# Altium project ntcsensor.PrjPcb
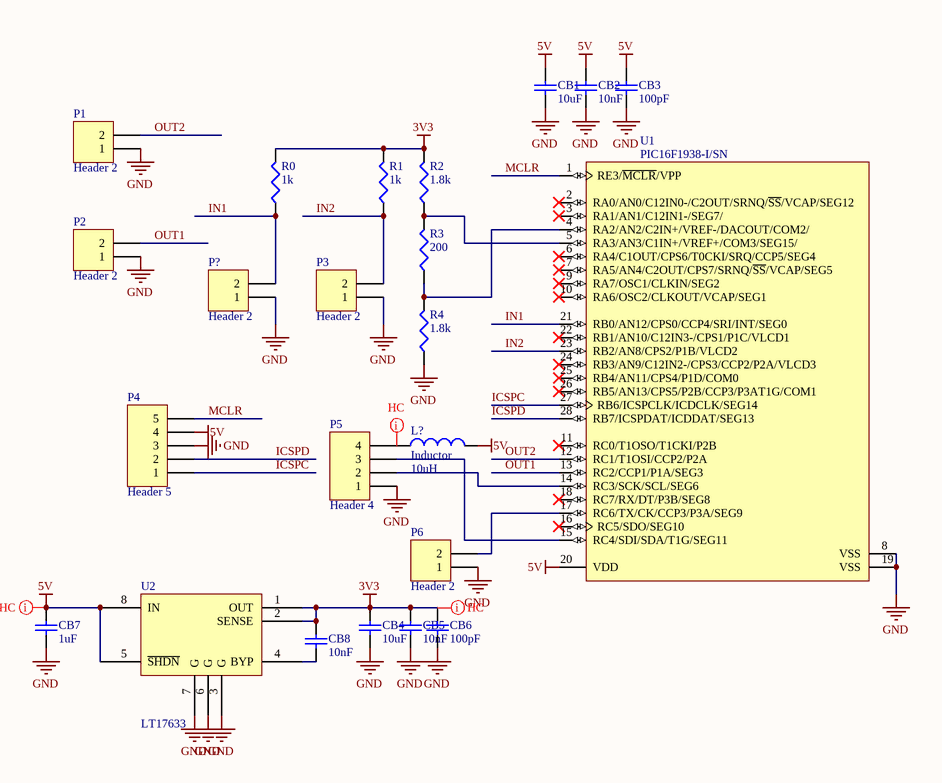
[diagram p0: ntcsensor.SchDoc]
1 sheet, 23 parts. Net scope: global (net labels, ports and power ports of the same name join across sheets).
Board file: ntcsensor.PcbDoc

## Sheet ntcsensor.SchDoc
size A4

### Parts
CB1  10uF  [MY_0805]
CB2  10nF  [MY_0805]
CB3  100pF  [MY_0805]
CB4  10uF  [MY_0805]
CB5  10nF  [MY_0805]
CB6  100pF  [MY_0805]
CB7  1uF  [MY_0805]
CB8  10nF  [MY_0805]
L?  Inductor  value 10uH  [INDC4532]
P1  Header 2  [HDR1X2]
P2  Header 2  [HDR1X2]
P3  Header 2  [HDR1X2]
P4  Header 5  [HDR1X5]
P5  Header 4  [HDR1X4]
P6  Header 2  [HDR1X2]
P?  Header 2  [HDR1X2]
R0  1k  [MY_0603]
R1  1k  [MY_0603]
R2  1.8k  [MY_0603]
R3  200  [MY_0603]
R4  1.8k  [MY_0603]
U1  PIC16F1938-I/SN  [SOIC-SO28_N]
U2  LT17633  [SOP8LDO]

### Nets
3V3: CB4.2 CB5.2 CB6.2 CB8.2 R0.2 R1.2 R2.2 U2.1(OUT) U2.2(SENSE)
5V: CB1.2 CB2.2 CB3.2 CB7.2 L?.2 P4.4 U1.20(VDD) U2.5(~{SHDN}) U2.8(IN)
GND: CB1.1 CB2.1 CB3.1 CB4.1 CB5.1 CB6.1 CB7.1 P1.1 P2.1 P3.1 P4.3 P5.1 P6.1 P?.1 R4.1 U1.8(VSS) U1.19(VSS) U2.3(G) U2.6(G) U2.7(G)
ICSPC: P4.1 U1.27(RB6/ICSPCLK/ICDCLK/SEG14)
ICSPD: P4.2 U1.28(RB7/ICSPDAT/ICDDAT/SEG13)
IN1: P?.2 R0.1 U1.21(RB0/AN12/CPS0/CCP4/SRI/INT/SEG0)
IN2: P3.2 R1.1 U1.23(RB2/AN8/CPS2/P1B/VLCD2)
MCLR: P4.5 U1.1(RE3/~{MCLR}/VPP)
OUT1: P2.2 U1.13(RC2/CCP1/P1A/SEG3)
OUT2: P1.2 U1.12(RC1/T1OSI/CCP2/P2A)
NetCB8_1: CB8.1 U2.4(BYP)
NetL?_1: L?.1 P5.4
NetP5_2: P5.2 U1.14(RC3/SCK/SCL/SEG6)
NetP5_3: P5.3 U1.15(RC4/SDI/SDA/T1G/SEG11)
NetP6_2: P6.2 U1.17(RC6/TX/CK/CCP3/P3A/SEG9)
NetR2_1: R2.1 R3.2 U1.5(RA3/AN3/C1IN+/VREF+/COM3/SEG15/)
NetR3_1: R3.1 R4.2 U1.4(RA2/AN2/C2IN+/VREF-/DACOUT/COM2/)

Not connected (* = marked no-connect by the designer): U1 2(RA0/AN0/C12IN0-/C2OUT/SRNQ/~{SS}/VCAP/SEG12)* 3(RA1/AN1/C12IN1-/SEG7/)* 6(RA4/C1OUT/CPS6/T0CKI/SRQ/CCP5/SEG4)* 7(RA5/AN4/C2OUT/CPS7/SRNQ/~{SS}/VCAP/SEG5)* 9(RA7/OSC1/CLKIN/SEG2)* 10(RA6/OSC2/CLKOUT/VCAP/SEG1)* 11(RC0/T1OSO/T1CKI/P2B)* 16(RC5/SDO/SEG10)* 18(RC7/RX/DT/P3B/SEG8)* 22(RB1/AN10/C12IN3-/CPS1/P1C/VLCD1)* 24(RB3/AN9/C12IN2-/CPS3/CCP2/P2A/VLCD3)* 25(RB4/AN11/CPS4/P1D/COM0)* 26(RB5/AN13/CPS5/P2B/CCP3/P3AT1G/COM1)*

### Layout directives
net class HC: 3V3, 5V, NetL?_1

### Library data of the parts
CB1 CB2 CB4 CB5 CB7 CB8 = Cap Semi: Capacitor (Semiconductor SIM Model); Value: 100pF; Published: 8-Jun-2000; LatestRevisionDate: 29-May-2009; LatestRevisionNote: IPC-7351 Footprint Added.; PackageReference: C1206; Publisher: Altium Limited; PackageDescription: Chip Capacitor
CB3 CB6 = Cap Semi: Capacitor (Semiconductor SIM Model); Published: 8-Jun-2000; LatestRevisionDate: 29-May-2009; LatestRevisionNote: IPC-7351 Footprint Added.; PackageReference: C1206; Publisher: Altium Limited; PackageDescription: Chip Capacitor; Value: 100pF
L? = Inductor: Code_IEC: 1005; Published: 8-Jun-2000; LatestRevisionDate: 29-May-2009; LatestRevisionNote: IPC-7351 Footprint Added.; PackageReference: 0402-A; Publisher: Altium Limited; PackageDescription: Chip Inductor; Code_JEITA: 0402
P1-P3 P6 P? = Header 2: Header, 2-Pin; LatestRevisionDate: 17-Jul-2002; LatestRevisionNote: Re-released for DXP Platform.; Publisher: Altium Limited
P4 = Header 5: Header, 5-Pin; LatestRevisionDate: 17-Jul-2002; LatestRevisionNote: Re-released for DXP Platform.; Publisher: Altium Limited
P5 = Header 4: Header, 4-Pin; LatestRevisionDate: 17-Jul-2002; LatestRevisionNote: Re-released for DXP Platform.; Publisher: Altium Limited
R0 R1 = Res3: Resistor; Published: 8-Jun-2000; LatestRevisionDate: 29-May-2009; LatestRevisionNote: IPC-7351 Footprint Added.; PackageReference: J1-0603; Publisher: Altium Limited; PackageDescription: Chip Resistor; Value: 1K
R2-R4 = Res3: Resistor; Value: 1K; Published: 8-Jun-2000; LatestRevisionDate: 29-May-2009; LatestRevisionNote: IPC-7351 Footprint Added.; PackageReference: J1-0603; Publisher: Altium Limited; PackageDescription: Chip Resistor
U1 = PIC16F1936-I/SO: CMOS Microcontroller with LCD Driver, 8K (words) Program Memory, 256 Bytes Data Memory, 512 Bytes SRAM, 25 I/O's, 28-Pin SOIC, Industrial Temperature; Published: 40149; LatestRevisionDate: 11-Aug-2010; LatestRevisionNote: Sch. layout revised.; DatasheetVersion: revC, Sep-2009; PackageVersion: revBB, Aug-2009; PackageReference: SOIC-SO28; Publisher: Altium Limited; PackageDescription: 28-Lead Plastic Small Outline (SO) - Wide 7.50mm Body [SOIC]; Supplier 1: Digi-Key; Supplier Part Number 1: PIC16F1936-I/SO-ND; Supplier 2: Farnell; Supplier Part Number 2: 1755820; Code_JEDEC: MS-013; ComponentLink1Description: Datasheet; ComponentLink1URL: http://ww1.microchip.com/downloads/en/DeviceDoc/41364C.pdf; ComponentLink2Description: Packaging Specification; ComponentLink2URL: http://www.microchip.com/stellent/groups/techpub_sg/documents/packagingspec/en012702.pdf; ComponentLink3Description: Microchip.com Home; ComponentLink3URL: http://www.microchip.com/